# Altium schematic sheet MCU-connectors-schematic.SchDoc
size A4; SheetNumber: 2; SheetTotal: 2
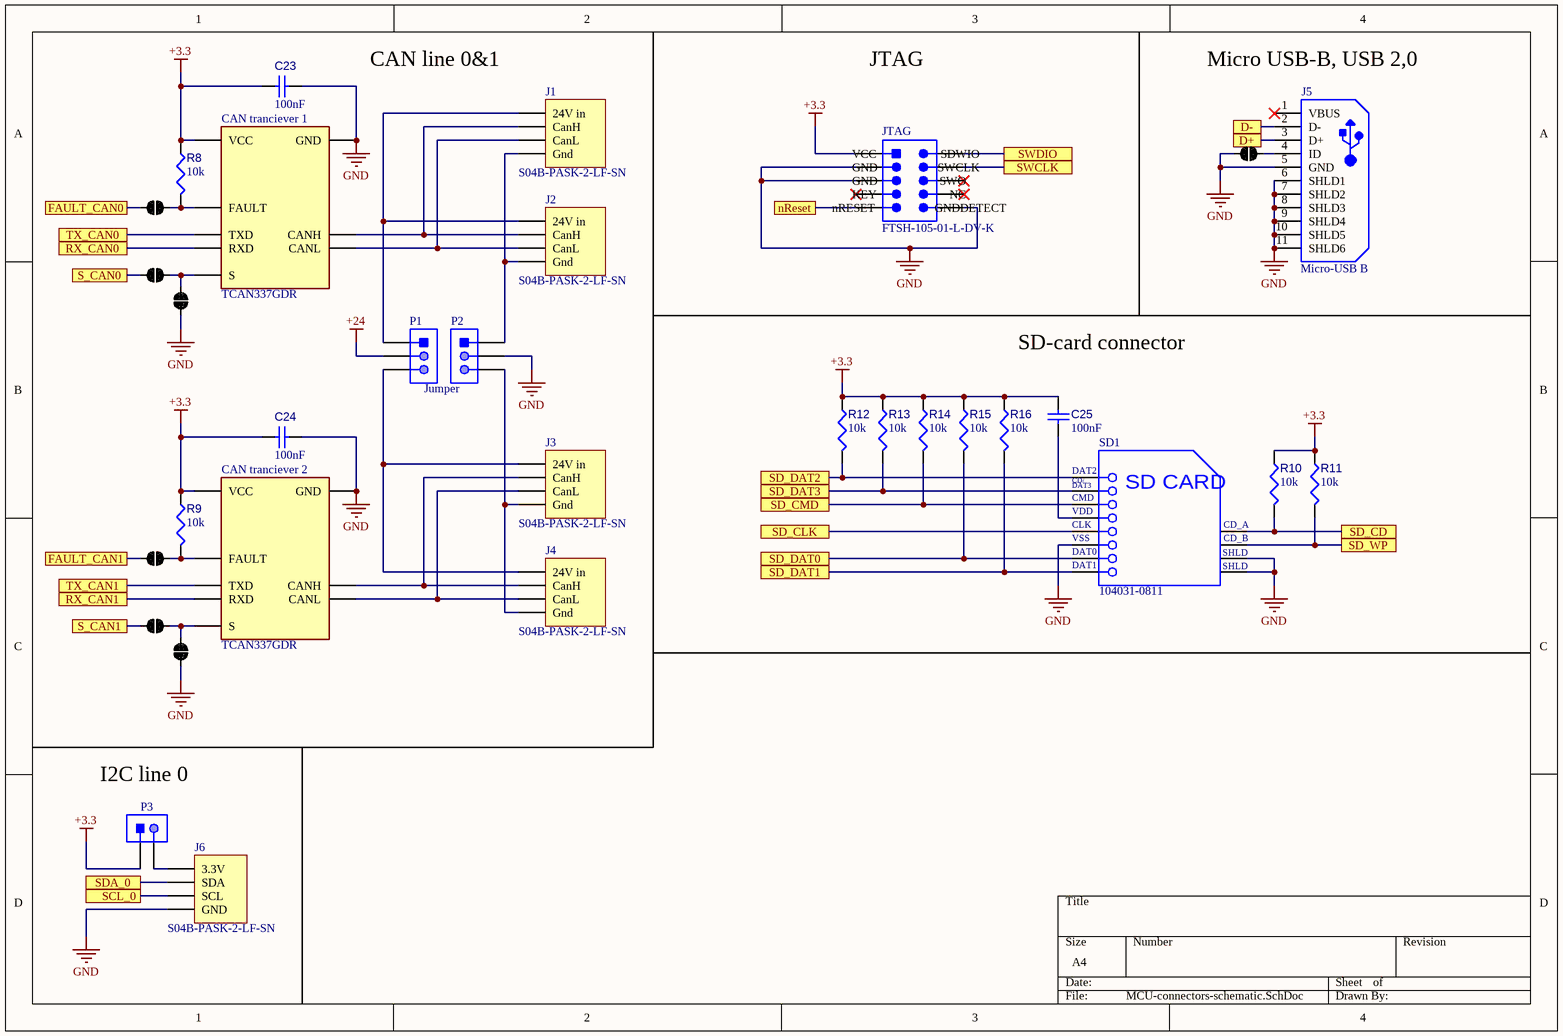
[diagram p0: MCU-connectors-schematic.SchDoc]

## Parts
C23  value 100nF  [CAPC1608X90X40ML10T20]  (hidden comment: Capacitor 100 nF +/-10% 50 V 0603)
C24  value 100nF  [CAPC1608X90X40ML10T20]  (hidden comment: Capacitor 100 nF +/-10% 50 V 0603)
C25  value 100nF  [CAPC1608X90X40ML10T20]  (hidden comment: Capacitor 100 nF +/-10% 50 V 0603)
CAN_tranciever_1  TCAN337GDR  [FP-D0008A-IPC_B]
CAN_tranciever_2  TCAN337GDR  [FP-D0008A-IPC_B]
J1  S04B-PASK-2-LF-SN  [JST-B4B-PH-K-S_V]
J2  S04B-PASK-2-LF-SN  [JST-B4B-PH-K-S_V]
J3  S04B-PASK-2-LF-SN  [JST-B4B-PH-K-S_V]
J4  S04B-PASK-2-LF-SN  [JST-B4B-PH-K-S_V]
J5  Micro-USB B  [USB-MICRO-B_V]
J6  S04B-PASK-2-LF-SN  [JST-B4B-PH-K-S_V]
JTAG  FTSH-105-01-L-DV-K  [SMTC-FTSH-105-01-L-DV-K_V]
P1  22-28-4033  [MOLX-22-28-4033_V]  (value not drawn)
P2  22-28-4033  [MOLX-22-28-4033_V]  (value not drawn)
P3  61900211121  [61900211121]  (value not drawn)
R8  value 10k  [RESC1608X55X25ML10T15]  (hidden comment: Resistor 10k +/-1% 0603 100 mW)
R9  value 10k  [RESC1608X55X25ML10T15]  (hidden comment: Resistor 10k +/-1% 0603 100 mW)
R10  value 10k  [RESC1608X55X25ML10T15]  (hidden comment: Resistor 10k +/-1% 0603 100 mW)
R11  value 10k  [RESC1608X55X25ML10T15]  (hidden comment: Resistor 10k +/-1% 0603 100 mW)
R12  value 10k  [RESC1608X55X25ML10T15]  (hidden comment: Resistor 10k +/-1% 0603 100 mW)
R13  value 10k  [RESC1608X55X25ML10T15]  (hidden comment: Resistor 10k +/-1% 0603 100 mW)
R14  value 10k  [RESC1608X55X25ML10T15]  (hidden comment: Resistor 10k +/-1% 0603 100 mW)
R15  value 10k  [RESC1608X55X25ML10T15]  (hidden comment: Resistor 10k +/-1% 0603 100 mW)
R16  value 10k  [RESC1608X55X25ML10T15]  (hidden comment: Resistor 10k +/-1% 0603 100 mW)
SD1  104031-0811  [MOLX-104031-0811_V]
SJ1  custom Solder bridge  [custom Solder bridge-Footprint-1]  (value not drawn)
SJ2  custom Solder bridge  [custom Solder bridge-Footprint-1]  (value not drawn)
SJ3  custom Solder bridge  [custom Solder bridge-Footprint-1]  (value not drawn)
SJ4  custom Solder bridge  [custom Solder bridge-Footprint-1]  (value not drawn)
SJ5  custom Solder bridge  [custom Solder bridge-Footprint-1]  (value not drawn)
SJ6  custom Solder bridge  [custom Solder bridge-Footprint-1]  (value not drawn)
SJ7  custom Solder bridge  [custom Solder bridge-Footprint-1]  (value not drawn)

## Ports
D+, D-, FAULT_CAN0, FAULT_CAN1, nReset, RX_CAN0, RX_CAN1, S_CAN0, S_CAN1, SCL_0, SD_CD, SD_CLK, SD_CMD, SD_DAT0, SD_DAT1, SD_DAT2, SD_DAT3, SD_WP, SDA_0, SWCLK, SWDIO, TX_CAN0, TX_CAN1

## Nets
+3.3: C23.2 C24.2 C25.2 CAN_tranciever_1.3(VCC) CAN_tranciever_2.3(VCC) JTAG.1(VCC) P3.1 R8.1 R9.1 R10.1 R11.1 R12.1 R13.1 R14.1 R15.1 R16.1
+24: P1.2
GND: C23.1 C24.1 CAN_tranciever_1.2(GND) CAN_tranciever_2.2(GND) J5.5(GND) J5.6(SHLD1) J5.7(SHLD2) J5.8(SHLD3) J5.9(SHLD4) J5.10(SHLD5) J5.11(SHLD6) J6.4(GND) JTAG.3(GND) JTAG.5(GND) JTAG.10(GNDDETECT) P2.2 SD1.6(VSS2) SD1.11(SHLD1) SD1.12(SHLD2) SJ1.1 SJ4.1 SJ7.1
D+: J5.3(D+) ; port D+
D-: J5.2(D-) ; port D-
FAULT_CAN0: SJ6.1 ; port FAULT_CAN0
FAULT_CAN1: SJ3.1 ; port FAULT_CAN1
nReset: JTAG.9(nRESET) ; port nReset
RX_CAN0: CAN_tranciever_1.4(RXD) ; port RX_CAN0
RX_CAN1: CAN_tranciever_2.4(RXD) ; port RX_CAN1
S_CAN0: SJ5.1 ; port S_CAN0
S_CAN1: SJ2.1 ; port S_CAN1
SCL_0: J6.3(SCL) ; port SCL_0
SD_CD: R10.2 SD1.9(CD_A) ; port SD_CD
SD_CLK: SD1.5(CLK) ; port SD_CLK
SD_CMD: R14.2 SD1.3(VSS1) ; port SD_CMD
SD_DAT0: R15.2 SD1.7(DAT0) ; port SD_DAT0
SD_DAT1: R16.2 SD1.8(DAT1) ; port SD_DAT1
SD_DAT2: R12.2 SD1.1(CD/DAT3) ; port SD_DAT2
SD_DAT3: R13.2 SD1.2(CMD) ; port SD_DAT3
SD_WP: R11.2 SD1.10(CD_B) ; port SD_WP
SDA_0: J6.2(SDA) ; port SDA_0
SWCLK: JTAG.4(SWCLK) ; port SWCLK
SWDIO: JTAG.2(SDWIO) ; port SWDIO
TX_CAN0: CAN_tranciever_1.1(TXD) ; port TX_CAN0
TX_CAN1: CAN_tranciever_2.1(TXD) ; port TX_CAN1
NetC25_1: C25.1 SD1.4(VDD)
NetCAN_tranciever_1_5: CAN_tranciever_1.5(FAULT) R8.2 SJ6.2
NetCAN_tranciever_1_6: CAN_tranciever_1.6(CANL) J1.3(CanL) J2.3(CanL)
NetCAN_tranciever_1_7: CAN_tranciever_1.7(CANH) J1.2(CanH) J2.2(CanH)
NetCAN_tranciever_1_8: CAN_tranciever_1.8(S) SJ4.2 SJ5.2
NetCAN_tranciever_2_5: CAN_tranciever_2.5(FAULT) R9.2 SJ3.2
NetCAN_tranciever_2_6: CAN_tranciever_2.6(CANL) J3.3(CanL) J4.3(CanL)
NetCAN_tranciever_2_7: CAN_tranciever_2.7(CANH) J3.2(CanH) J4.2(CanH)
NetCAN_tranciever_2_8: CAN_tranciever_2.8(S) SJ1.2 SJ2.2
NetJ1_1: J1.1(24V_in) J2.1(24V_in) P1.1
NetJ1_4: J1.4(Gnd) J2.4(Gnd) P2.1
NetJ3_1: J3.1(24V_in) J4.1(24V_in) P1.3
NetJ3_4: J3.4(Gnd) J4.4(Gnd) P2.3
NetJ5_4: J5.4(ID) SJ7.2
NetJ6_1: J6.1(3.3V) P3.2

Not connected (* = marked no-connect by the designer): J5 1(VBUS)*; JTAG 6(SWO)* 7(KEY)* 8(NC)*

## Notes on the sheet
- CAN line 0&1
- JTAG
- (near J5) Micro USB-B, USB 2,0
- SD-card connector
- Jumper
- I2C line 0
- (in symbol CMP-2000-05825-1) DAT2; CD/; DAT3; SD CARD; VSS; SHLD

## Library data of the parts
C23-C25 = CMP-001-00017-4: Chip Capacitor, 100 nF, +/- 10%, 50 V, 0603 (1608 Metric); Capacitor Type: Ceramic; Voltage Rating: 50V; RoHS Compliant: True; Max Operating Temperature: 125°C; Pins: 2; Mounting Technology: SM; Min Operating Temperature: -55°C; Tolerance: 10%; Case/Package: 0603
CAN_tranciever_1 CAN_tranciever_2 = CMP-001-0002-3: 3.3-V CAN Transceivers with CAN FD (Flexible Data Rate) 8-SOIC -40 to 125
J1-J4 = CMP-002-00072-2
J5 = CMP-2000-05827-1: Micro-USB B Receptacle, Right Angle, Bottom Mount, Surface Mount, with Solder Tabs, -30 to 85 degC, 5-Pin USB, RoHS, Tape and Reel; Manufacturer: Molex; Featured Product: Micro-USBConnectorsUSBConnectors; Other Names: WM1399DKR; Package Version: Rev. F, 12/2012; Number of Contacts: 5; Connector Type: USB-microB; Catalog Drawings: 1050170001; 3D Model: 105017-0001.stp; Mating Products: WM17145-ND-CABLEMICROUSBBTOSTDA1.0MWM17147-ND-CABLEMICROUSBBTOSTDA2.0MWM17146-ND-CABLEMICROUSBBTOSTDA1.5M; PCN Assembly/Origin: ResinSupplier21/Oct/2015; Voltage - Max: 30V; Online Catalog: Molex-MicroUSB; Manufacturer URL: http://www.molex.com/; Package Description: 5-Leads USB, Micro B, Body 7.5 x 5 mm, Pitch 0.65 mm; Datasheet URL: http://www.molex.com/elqNow/elqRedir.htm?ref=http://www.molex.com/webdocs/datasheets/pdf/en-us/1050170001_IO_CONNECTORS.pdf; Ingress Protection: -; Datasheet Version: 03/2016; Mounting Type: BoardCutout,SurfaceMount,RightAngle; Circuits: 5; Standard Package: 1; Package Reference: MICRO-B; Package URL: http://www.molex.com/pdm_docs/sd/1050170001_sd.pdf; Category: Connectors,Interconnects; Series: -; RoHS Information: 1050170001CertofCompliance; Features: Shielded,SolderRetention; Family: USB,DVI,HDMIConnectors; Specifications: -; Gender: Receptacle; Packaging: Digi-Reel®; Mounting Technology: SurfaceMount
J6 = CMP-002-00074-1
JTAG = CMP-2000-05353-1: Male Header, Pitch 1.27 mm, 2 x 5 Position, Height 6.25 mm; Manufacturer: Samtec; Pitch: 0.050"(1.27mm); Other Names: Q3937619; Number of Positions: 10; Mating Products: SFMC-105-L2-S-D-TR-ND / -CONN.05"SURFACE10POSSMT / FLE-105-01-G-DV-TR-ND / -CONNSKT1.27MM10POSDUALSMD / FLE-105-01-G-DV-A-P-ND / -CONNSKT1.27MM10POSDUALSMD / FLE-105-01-G-DV-A-ND / -CONNSKT1.27MM10POSDUALSMD / CLP-105-02-G-D-P-TR-ND / -CONNRCPT10POSDUAL.05"SMD / SAM1155-05-ND / -CONNRCPT10POSDUAL.05"SMD / SAM1154-05-ND / -CONNRCPT10POSDUAL.05"SMD / SAM1153-05-ND / -CONNRCPT10POSDUAL.05"SMD / SAM1226-05-ND / -CONNRCPT.05"10POSDUALSMD; Number of Positions Loaded: All; Connector Type: Header,Unshrouded; Product Training Modules: Board-to-BoardConnectors; Datasheet Version: Rev. ET, 10/1995; Number of Rows: 2; Standard Package: 1; Package Description: Male Header, Pitch 1.27 mm, 2 x 5 Position, Height 5.97 mm, Tail Length 4.32 mm; Contact Finish Thickness: 10µin(0.25µm); Series: FTSH; Termination: Solder; Contact Type: MalePin; Color: Black; Package Reference: FTSH-105-01-L-DV-K; Family: RectangularConnectors-Headers,MalePins; Package URL: http://suddendocs.samtec.com/prints/ftsh-1xx-xx-xxx-dv-xxx-footprint.pdf; Packaging: Tube; Mounting Type: SurfaceMount; Category: Connectors,Interconnects; Datasheet URL: http://suddendocs.samtec.com/prints/ftsh-1xx-xx-xxx-dv-xxx-mkt.pdf; Row Spacing: 0.050"(1.27mm); Manufacturer URL: http://www.samtec.com/; Contact Mating Length: 0.120"(3.05mm); Contact Finish: Gold
P1 P2 = CMP-1676-00001-5: Male Header, Pitch 2.54 mm, 1 x 3 Position, Height 8.38 mm, Tail Length 3.18 mm, RoHS, Bulk; Manufacturer: Molex; Rows: 1; Voltage Rating: 250 V; Current Rating: 4 A; Min Operating Temperature: 0 degC; Lead Pitch: 0.1 inch; Packaging: Bulk; Contact Finish: Gold; RoHSCompliant: true; Contact Material: Brass; PackageReference: 22-28-4033; REACH SVHC: Unknown; PackageDescription: Male Header, Pitch 2.54 mm, 1 x 3 Position, Height 8.38 mm, Tail Length 3.18 mm; ComponentLink2URL: http://www.molex.com/pdm_docs/sd/022284033_sd.pdf; Height: 8.38 mm; Mounting Technology: Through Hole; ComponentLink1Description: Manufacturer URL; Length: 7.62 mm; Mount: Through Hole; DatasheetVersion: Rev. G, 01/2012; Max Operating Temperature: 75 degC; ComponentLink2Description: Datasheet; Colour: Black; Pins: 3; Contact Plating: Gold; Package Quantity: 1; ComponentLink1URL: http://www.molex.com/
P3 = CMP-1502-00584-1: Male Locking Header WR-WTB, THT, Vertical, pitch 2.54 mm, 1 x 2 position; Manufacturer: Wurth Elektronik; Position: 1x2; Contact Resistance: 20mOhm; Working Voltage: 250VAC; Pitch: 2.54mm; Gender: Male; Part Number: 61900211121; Mounting Technology: THT; Operating Temperature: -40to105degC; Orientation: Vertical; Packaging: Bag; Package Reference: 61900211121; Manufacturer URL: http://www.we-online.de; Datasheet URL: https://katalog.we-online.de/em/datasheet/6190xx11121.pdf; Publisher: WurthElektronik
R8-R16 = CMP-009-00017-4: Chip Resistor, 10 KOhm, +/- 1%, 01 W, -55 to 155 degC, 0603 (1608 Metric); Voltage Rating: 50V; Power: 100mW; Min Operating Temperature: -55°C; Tolerance: 1%; Case/Package: 0603; Pins: 2; Max Operating Temperature: 155°C; RoHS Compliant: True; Mounting Technology: SM
SD1 = CMP-2000-05825-1: Micro SD Card, RA, -25 to 85 degC, 8-Pin SMD, RoHS, Tape and Reel; Voltage Rating: 10VAC/DC; Number of Contacts: 8; Insertion - Extraction Style: Push-Pull; Pitch: 1.1mm; Mating Cycles: 10000; Brand: Molex; Current Rating: 500mA; Manufacturer URL: http://www.molex.com/; Card Type: microSD; Mounting Type: Standard; Height: 1.42mm; Mounting Technology: SurfaceMount; Contact Plating: Gold; Product Category: MemoryCardConnectors; Package Description: 8-Pin Surface Mount Device, Body 11.95 x 11.4 mm, Pitch 1.1 mm; Datasheet URL: http://www.molex.com/pdm_docs/sd/1040310811_sd.pdf; Termination Style: SMD; Length: 11.4mm; Housing Material: LiquidCrystalPolymer(LCP); Orientation: RightAngle; RoHS: True; Contact Material: PhosphorBronze; Datasheet Version: Rev. E, 04/2006; Packaging: Reel; Manufacturer: Molex; Series: 104031; Product: CardConnectors; Number of Rows: 1Row; Package Reference: 104031-0811
SJ1-SJ7 = CMP-002-00075-2